# Altium schematic sheet WSN.SchDoc
size D; SheetNumber: 1; SheetTotal: 1
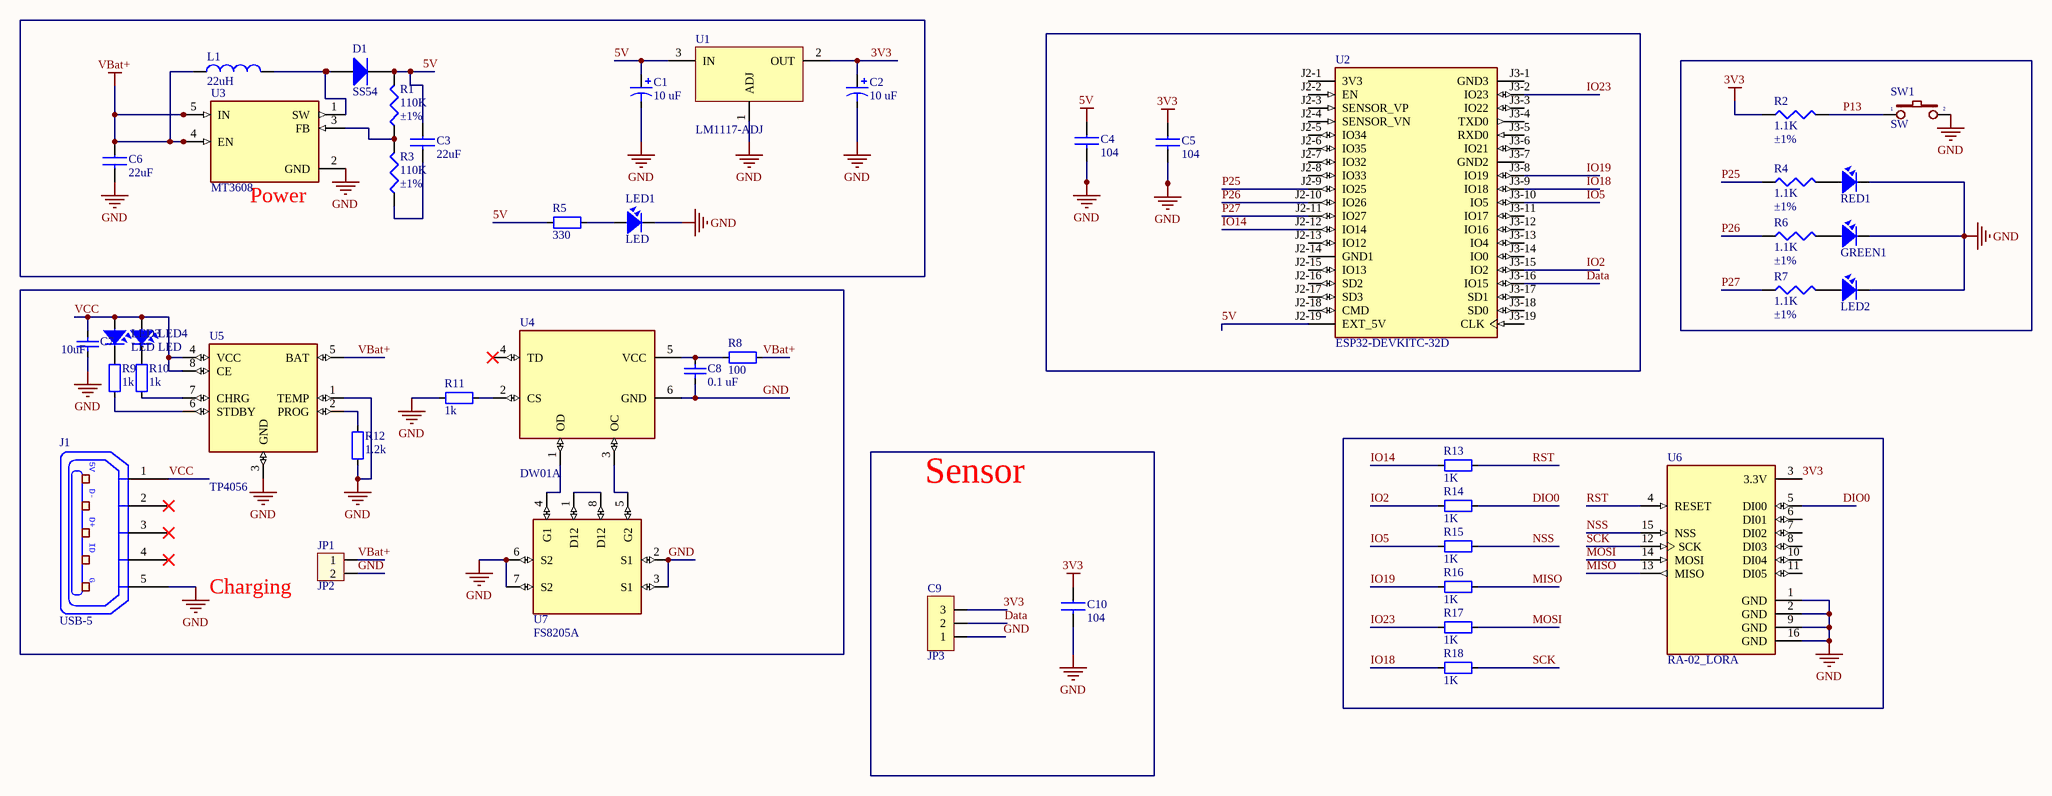
[diagram p0: WSN.SchDoc]

## Parts
C1  10 uF  [C3MM]
C2  10 uF  [C3MM]
C3  22uF  [CAP0603]
C4  104  [CAP0603]
C5  104  [CAP0603]
C6  22uF  [CAP0603]
C7  10uF  [CAP_0805]
C8  0.1 uF  [CAP_0805]
C9  JP3  [JP3-C1T]
C10  104  [CAP0603]
D1  SS54  [DIODE/POW/1A]
GREEN1  LED  [LED-3MM-GREEN]  (value not drawn)
J1  USB-5  [USB-M1]
JP1  JP2  [CON2]
L1  22uH  [IND_400_500_212x114_SMD]
LED1  LED  [LED-0805-Red]
LED2  LED  [LED-3MM-YELLOW]  (value not drawn)
LED3  LED  [LED-0805-Green]
LED4  LED  [LED-0805-Red]
R1  110K  Tolerance: ±1%  [RES0603]
R2  1.1K  Tolerance: ±1%  [RES0603]
R3  110K  Tolerance: ±1%  [RES0603]
R4  1.1K  Tolerance: ±1%  [RES0603]
R5  330  [RES-SMD-0805]
R6  1.1K  Tolerance: ±1%  [RES0603]
R7  1.1K  Tolerance: ±1%  [RES0603]
R8  100  [RES-SMD-0805]
R9  1k  [RES-SMD-0805]
R10  1k  [RES-SMD-0805]
R11  1k  [RES-SMD-0805]
R12  1.2k  [RES-SMD-0805]
R13  1K  [RES-SMD-0805]
R14  1K  [RES-SMD-0805]
R15  1K  [RES-SMD-0805]
R16  1K  [RES-SMD-0805]
R17  1K  [RES-SMD-0805]
R18  1K  [RES-SMD-0805]
RED1  LED  [LED-3MM-RED]  (value not drawn)
SW1  SW  [SW1-SMD]
U1  LM1117-ADJ  [LM1117-SOP]
U2  ESP32-DEVKITC-32D  [MODULE_ESP32-DEVKITC-32D]
U3  MT3608  [SOT95P280X145-6N]
U4  DW01A  [SOT23-6]
U5  TP4056  [TP4056]
U6  RA-02_LORA  [MODULE_RA-02_LORA]
U7  FS8205A  [FS8205A]

## Nets
3V3: C2.1 C5.1 C9.3 C10.1 R2.1 U1.2(OUT) U6.3(3.3V)
5V: C1.1 C3.1 C4.1 D1.2(K) R1.2 R5.1 U1.3(IN) U2.J2-19(EXT_5V)
GND: C1.2 C2.2 C4.2 C5.2 C6.2 C7.1 C8.1 C9.1 C10.2 GREEN1.2 J1.5(P5) JP1.2 LED1.2 LED2.2 R11.1 R12.1 RED1.2 SW1.2 U1.1(ADJ) U3.2(GND) U4.6(GND) U5.1(TEMP) U5.3(GND) U6.1(GND) U6.2(GND) U6.9(GND) U6.16(GND) U7.2(S1) U7.3(S1) U7.6(S2) U7.7(S2)
VBat+: C6.1 JP1.1 L1.1 R8.2 U3.4(EN) U3.5(IN) U5.5(BAT)
Data: C9.2 U2.J3-16(IO15)
DIO0: R14.2 U6.5(DI00)
IO2: R14.1 U2.J3-15(IO2)
IO5: R15.1 U2.J3-10(IO5)
IO14: R13.1 U2.J2-12(IO14)
IO18: R18.1 U2.J3-9(IO18)
IO19: R16.1 U2.J3-8(IO19)
IO23: R17.1 U2.J3-2(IO23)
MISO: R16.2 U6.13(MISO)
MOSI: R17.2 U6.14(MOSI)
NSS: R15.2 U6.15(NSS)
P13: R2.2 SW1.1
P25: R4.1 U2.J2-9(IO25)
P26: R6.1 U2.J2-10(IO26)
P27: R7.1 U2.J2-11(IO27)
RST: R13.2 U6.4(RESET)
SCK: R18.2 U6.12(SCK)
VCC: C7.2 J1.1(P1) LED3.1 LED4.1 U5.4(VCC) U5.8(CE)
NetC3_2: C3.2 R3.1
NetC8_2: C8.2 R8.1 U4.5(VCC)
NetD1_1: D1.1(A) L1.2 U3.1(SW)
NetGREEN1_1: GREEN1.1 R6.2
NetLED1_1: LED1.1 R5.2
NetLED2_1: LED2.1 R7.2
NetLED3_2: LED3.2 R9.2
NetLED4_2: LED4.2 R10.2
NetR1_1: R1.1 R3.2 U3.3(FB)
NetR4_2: R4.2 RED1.1
NetR9_1: R9.1 U5.6(STDBY)
NetR10_1: R10.1 U5.7(CHRG)
NetR11_2: R11.2 U4.2(CS)
NetR12_2: R12.2 U5.2(PROG)
NetU4_1: U4.1(OD) U7.4(G1)
NetU4_3: U4.3(OC) U7.5(G2)
NetU7_1: U7.1(D12) U7.8(D12)

Not connected (* = marked no-connect by the designer): J1 2(P2)* 3(P3)* 4(P4)*; U2 J2-1(3V3) J2-2(EN) J2-3(SENSOR_VP) J2-4(SENSOR_VN) J2-5(IO34) J2-6(IO35) J2-7(IO32) J2-8(IO33) J2-13(IO12) J2-14(GND1) J2-15(IO13) J2-16(SD2) J2-17(SD3) J2-18(CMD) J3-1(GND3) J3-3(IO22) J3-4(TXD0) J3-5(RXD0) J3-6(IO21) J3-7(GND2) J3-11(IO17) J3-12(IO16) J3-13(IO4) J3-14(IO0) J3-17(SD1) J3-18(SD0) J3-19(CLK); U4 4(TD)*; U6 6(DI01) 7(DI02) 8(DI03) 10(DI04) 11(DI05)

## Notes on the sheet
- (near U3) Power
- Sensor
- (near JP1) Charging
- (in symbol USB-5) 5V; D-; D+; ID; G

## Library data of the parts
C1 C2 = Cap Pol: Polarized Capacitor (Axial); Published: 8-Jun-2000; LatestRevisionDate: 17-Jul-2002; LatestRevisionNote: Re-released for DXP Platform.; PackageReference: POLAR0.8; Publisher: Altium Limited
C3-C6 C10 = CC0603JRNPO9BN300: CAP CER 30PF 50V NPO 0603; Manufacturer: Yageo; Tolerance: ±5%; Temperature Coefficient: C0G, NP0; Notification: Current market demand for these product types have resulted in fluctuating and extending lead times. Lead times may differ.; Supplier 1: Digi-Key; Manufacturer Part Number: CC0603JRNPO9BN300; RoHS: RoHS Compliant; Category: Capacitors; Stock 1: 0; Pricing 1: 1=0.1, 10=0.041, 100=0.0182, 500=0.01302, 1000=0.01022 (USD); Packaging: Cut Tape (CT); Part Status: Active; Voltage - Rated: 50V; Operating Temperature: -55°C ~ 125°C; Features: -; Ratings: -; Applications: General Purpose; Failure Rate: -; Mounting Type: Surface Mount, MLCC; Package / Case: 0603 (1608 Metric); Size / Dimension: 0.063" L x 0.032" W (1.60mm x 0.80mm); Height - Seated (Max): -; Thickness (Max): 0.035" (0.90mm); Lead Spacing: -; Lead Style: -; ComponentLink1URL: http://www.yageo.com/documents/recent/UPY-GP_NP0_16V-to-50V_16.pdf; ComponentLink1Description: http://www.yageo.com/documents/recent/UPY-GP_NP0_16V-to-50V_16.pdf; Supplier Part Number 1: 311-3357-1-ND
C7 C8 = CapSMD: Capacitor; Value: 33p; Published: 8-Jun-2000; LatestRevisionDate: 17-Jul-2002; LatestRevisionNote: Re-released for DXP Platform.; PackageReference: RAD-0.3; Publisher: Altium Limited
C9 = JP3: WR-PHD 2.54 mm Angled Socket Header; Manufacturer: W¨¹rth Elektronik eiSos GmbH; partNo: 613003143121; ComponentLink1 Description: Manufacturer; ComponentLink2 Description: Datasheet; NoPins: 03; Created Date: 29 March 2013; ComponentLink1URL: http://www.we-online.com; ComponentLink2URL: http://katalog.we-online.de/em/datasheet/6130xx143121.pdf; Created by: Karrer Zheng
D1 = Diode Power: Published: 8-Jun-2000; LatestRevisionDate: 17-Jul-2002; LatestRevisionNote: Re-released for DXP Platform.; DatasheetDocument: 1998; PackageDocument: Aug-1999; PackageReference: DO-201AD; Publisher: Altium Limited; ComponentLink1Description: Manufacturer Link; ComponentLink1URL: http://www.fairchildsemi.com/; ComponentLink2Description: Datasheet; ComponentLink2URL: http://www.fairchildsemi.com/ds/1N%2F1N5400.pdf
GREEN1 LED1-LED4 RED1 = LED: LED Single colour Green and Red; Value: LED 3 ly Single Colour
J1 = USB-5: Manufacturer: FCI; Manufacturer Part Number: 10118193-0001LF; Connector Type: USB - micro B; Number of Contacts: 5; Gender: Receptacle; Specifications: USB 2.0; .Creator: MM; .Checked PCB: RF; Supplier 1: Digi-Key; RoHS: RoHS Compliant; Category: Connectors, Interconnects; Stock 1: 28642; Pricing 1: 1=0.46, 10=0.433, 25=0.3712, 50=0.3156, 100=0.3032, 250=0.27224, 500=0.25988 (USD); Packaging: Cut Tape (CT); Mounting Type: Surface Mount, Right Angle, Horizontal; Features: Shielded, Solder Retention; Ingress Protection: -; ComponentLink1URL: http://portal.fciconnect.com/Comergent//fci/drawing/10118193.pdf; ComponentLink1Description: http://portal.fciconnect.com/Comergent//fci/drawing/10118193.pdf; Supplier Part Number 1: 609-4616-1-ND; .Checked SCH: MM
JP1 = Con2: Connector 2; Value: Connector 2
L1 = IND_1mH-0.6A-20%-SMD: 1mH Shielded Wirewound Inductor 600mA 1.82Ohm Max Nonstandard; Manufacturer: Coilcraft; Manufacturer Part Number: 74477030; Alternate Part Number-1: NA; Case/Package: SMD; Supplier-1: WURTH; Supplier Part Number-1: 74477030
R1-R4 R6 R7 = RT0603FRD071KL: RES SMD 1K OHM 1% 1/10W 0603; Manufacturer: Yageo; Power (Watts): 0.1W, 1/10W; Temperature Coefficient: ±25ppm/°C; Supplier 1: Digi-Key; Manufacturer Part Number: RT0603FRD071KL; RoHS: RoHS Compliant; Category: Resistors; Stock 1: 0; Pricing 1: 1=0.17, 10=0.143, 100=0.0561, 1000=0.02346, 2500=0.02151 (USD); Packaging: Cut Tape (CT); Part Status: Active; Composition: Thin Film; Features: Moisture Resistant; Operating Temperature: -55°C ~ 155°C; Package / Case: 0603 (1608 Metric); Supplier Device Package: 0603; Size / Dimension: 0.063" L x 0.032" W (1.60mm x 0.80mm); Height - Seated (Max): 0.022" (0.55mm); Failure Rate: -; ComponentLink1URL: http://www.yageo.com/documents/recent/PYu-RT_1-to-0.01_RoHS_L_9.pdf; ComponentLink1Description: http://www.yageo.com/documents/recent/PYu-RT_1-to-0.01_RoHS_L_9.pdf; Supplier Part Number 1: YAG5719CT-ND; Value: 1K
R5 R8-R18 = Resistor - SMD: Resistor; Manufacturer: Generic Components; Class: Passive; Published: 08/06/2000; Publisher: Altium Hobart Technology Centre
SW1 = SW2: Switch button 2 pin; Value: SW chip 2 pin
U1 = LM1117-ADJ: 800mA Low-Dropout Linear Regulator; Creator: Nguyen Ba Bien; Website: http://group3i.net
U2 = ESP32-DEVKITC-32D: WiFi Development Tools (802.11) ESP32 General Development Kit, ESP32-WROOM-32D on the board; MF: Espressif Systems; SnapEDA_Link: https://www.snapeda.com/parts/ESP32-DEVKITC-32D/Espressif+Systems/view-part/?ref=snap; Package: None; Value: *; MP: ESP32-DEVKITC-32D; Check_prices: https://www.snapeda.com/parts/ESP32-DEVKITC-32D/Espressif+Systems/view-part/?ref=eda
U3 = MT3608: High Efficiency 1.2MHz2A Step Up Converter; MF: Aerosemi Technology Co., Ltd; Price: None; Availability: Not in stock; Package: Package; MP: MT3608; Value: *; SnapEDA_Link: https://www.snapeda.com/parts/MT3608/Aerosemi+Technology+Co.%252C+Ltd/view-part/?ref=snap; Check_prices: https://www.snapeda.com/parts/MT3608/Aerosemi+Technology+Co.%252C+Ltd/view-part/?ref=eda
U4 = DW01A: One Cell Lithium-ion/Polymer Battery Protection IC
U5 = TP4056: Complete single cell Li-Ion battery with a constant current / constant voltage linear charger
U6 = RA-02_LORA: Ra-02 LoRa RF M5Stack Platform Evaluation Expansion Board; Price: None; Availability: Unavailable; MP: RA-02_LORA; Value: *; Package: None